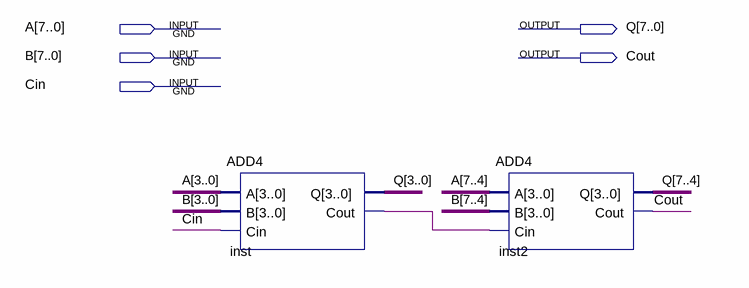
[diagram p0: schematic sheet]
// Quartus schematic ADD8.bdf as structural Verilog: 2 symbols, 5 pins
module ADD8 (
  input  [7:0] A,
  input  [7:0] B,
  input  Cin,
  output [7:0] Q,
  output Cout
);

  wire inst_cout;

  ADD4 inst (.A(A[3:0]), .B(B[3:0]), .Cin(Cin), .Q(Q[3:0]), .Cout(inst_cout));
  ADD4 inst2 (.A(A[7:4]), .B(B[7:4]), .Cin(inst_cout), .Q(Q[7:4]), .Cout(Cout));
endmodule
